# EAGLE design Linkwitz_mod (EAGLE 6.1)
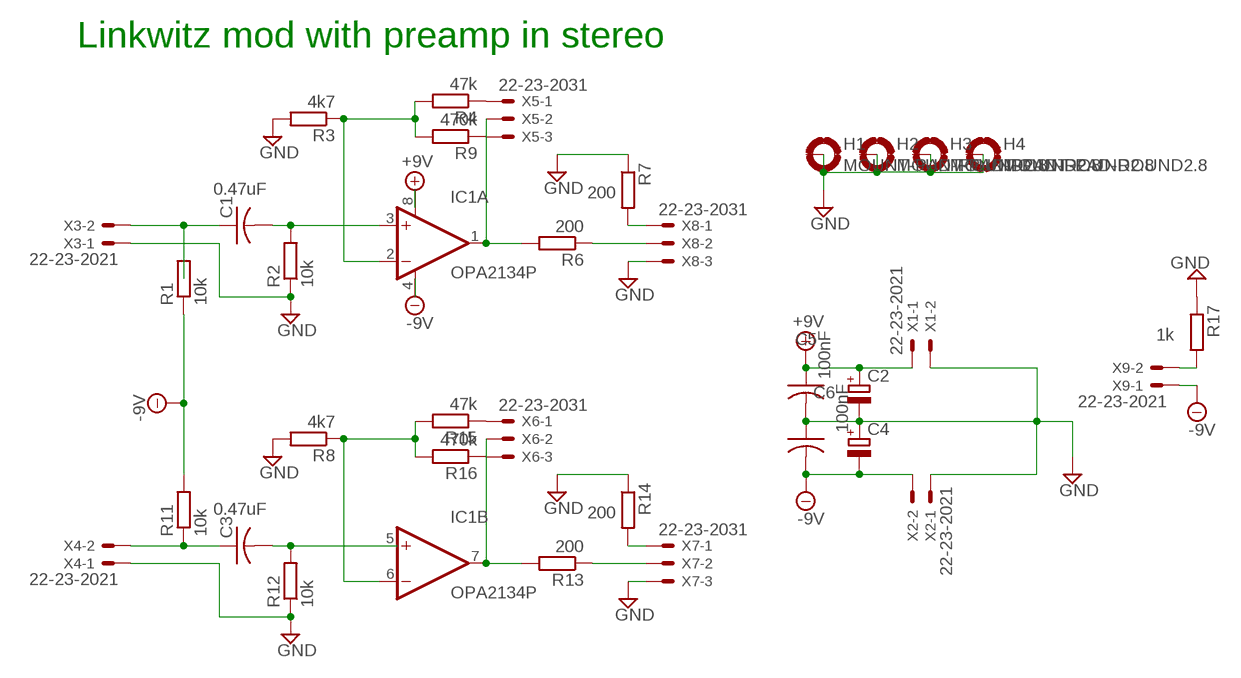
[diagram p0: schematic, sheet 1]

## Parts
C1  0.47uF  C-US050-030X075  [C050-030X075]
C2  CPOL-EUE2,5-6E  [E2,5-6E]
C3  0.47uF  C-US050-030X075  [C050-030X075]
C4  CPOL-EUE2,5-6E  [E2,5-6E]
C5  100nF  C-US050-030X075  [C050-030X075]
C6  100nF  C-US050-030X075  [C050-030X075]
H1  MOUNT-PAD-ROUND2.8  [2,8-PAD]
H2  MOUNT-PAD-ROUND2.8  [2,8-PAD]
H3  MOUNT-PAD-ROUND2.8  [2,8-PAD]
H4  MOUNT-PAD-ROUND2.8  [2,8-PAD]
IC1  OPA2134P  [DIL08]
R1  10k  R-EU_0309/10  [0309/10]
R2  10k  R-EU_0309/10  [0309/10]
R3  4k7  R-EU_0309/10  [0309/10]
R4  47k  R-EU_0309/10  [0309/10]
R6  200  R-EU_0309/10  [0309/10]
R7  200  R-EU_0309/10  [0309/10]
R8  4k7  R-EU_0309/10  [0309/10]
R9  470k  R-EU_0309/10  [0309/10]
R11  10k  R-EU_0309/10  [0309/10]
R12  10k  R-EU_0309/10  [0309/10]
R13  200  R-EU_0309/10  [0309/10]
R14  200  R-EU_0309/10  [0309/10]
R15  47k  R-EU_0309/10  [0309/10]
R16  470k  R-EU_0309/10  [0309/10]
R17  1k  R-EU_0309/10  [0309/10]
X1  22-23-2021  [22-23-2021]
X2  22-23-2021  [22-23-2021]
X3  22-23-2021  [22-23-2021]
X4  22-23-2021  [22-23-2021]
X5  22-23-2031  [22-23-2031]
X6  22-23-2031  [22-23-2031]
X7  22-23-2031  [22-23-2031]
X8  22-23-2031  [22-23-2031]
X9  22-23-2021  [22-23-2021]

## Nets
+9V: C2.+ C5.1 IC1.8(A:V+) X1.1
-9V: C4.- C6.2 IC1.4(A:V-) R1.1 R11.2 X2.2 X9.1
GND: C2.- C4.+ C5.2 C6.1 R2.1 R3.2 R7.1 R8.2 R12.1 R14.1 R17.1 X1.2 X2.1 X3.1 X4.1 X7.3 X8.3
N$1: C1.1 R1.2 X3.2
N$2: IC1.6(B:-IN) R8.1 R15.2 R16.2
N$3: IC1.2(A:-IN) R3.1 R4.2 R9.2
N$4: C1.2 IC1.3(A:+IN) R2.2
N$5: IC1.1(A:OUT) R6.2 X5.2
N$7: R14.2 X7.1
N$8: R6.1 X8.2
N$9: R4.1 X5.1
N$10: R9.1 X5.3
N$11: IC1.7(B:OUT) R13.2 X6.2
N$13: R7.2 X8.1
N$14: C3.1 R11.1 X4.2
N$15: C3.2 IC1.5(B:+IN) R12.2
N$16: R13.1 X7.2
N$17: R15.1 X6.1
N$18: R16.1 X6.3
N$19: R17.2 X9.2
Unconnected: H1.B2,8(MOUNT) H2.B2,8(MOUNT) H3.B2,8(MOUNT) H4.B2,8(MOUNT)

## Notes on the sheet
- Linkwitz mod with preamp in stereo

## Library data of the parts
C1 C3 C5 C6 = rcl:C-US: CAPACITOR, American symbol
C2 C4 = rcl:CPOL-EU: POLARIZED CAPACITOR, European symbol
H1-H4 = holes:MOUNT-PAD-ROUND: MOUNTING PAD, round
IC1 = burr-brown:OPA2134: Operational Amplifier; MF: TEXAS INSTRUMENTS; MPN: OPA2134PA; OC_FARNELL: 1097574; OC_NEWARK: 74K3897
R1-R4 R6-R9 R11-R17 = rcl:R-EU_: RESISTOR, European symbol
X1-X4 X9 = con-molex:22-23-2021: .100" (2.54mm) Center Header - 2 Pin; MF: MOLEX; MPN: 22-23-2021; OC_FARNELL: 1462926; OC_NEWARK: 25C3832
X5-X8 = con-molex:22-23-2031: .100" (2.54mm) Center Header - 3 Pin; MF: MOLEX; MPN: 22-23-2031; OC_FARNELL: 1462950; OC_NEWARK: 30C0862

## Board
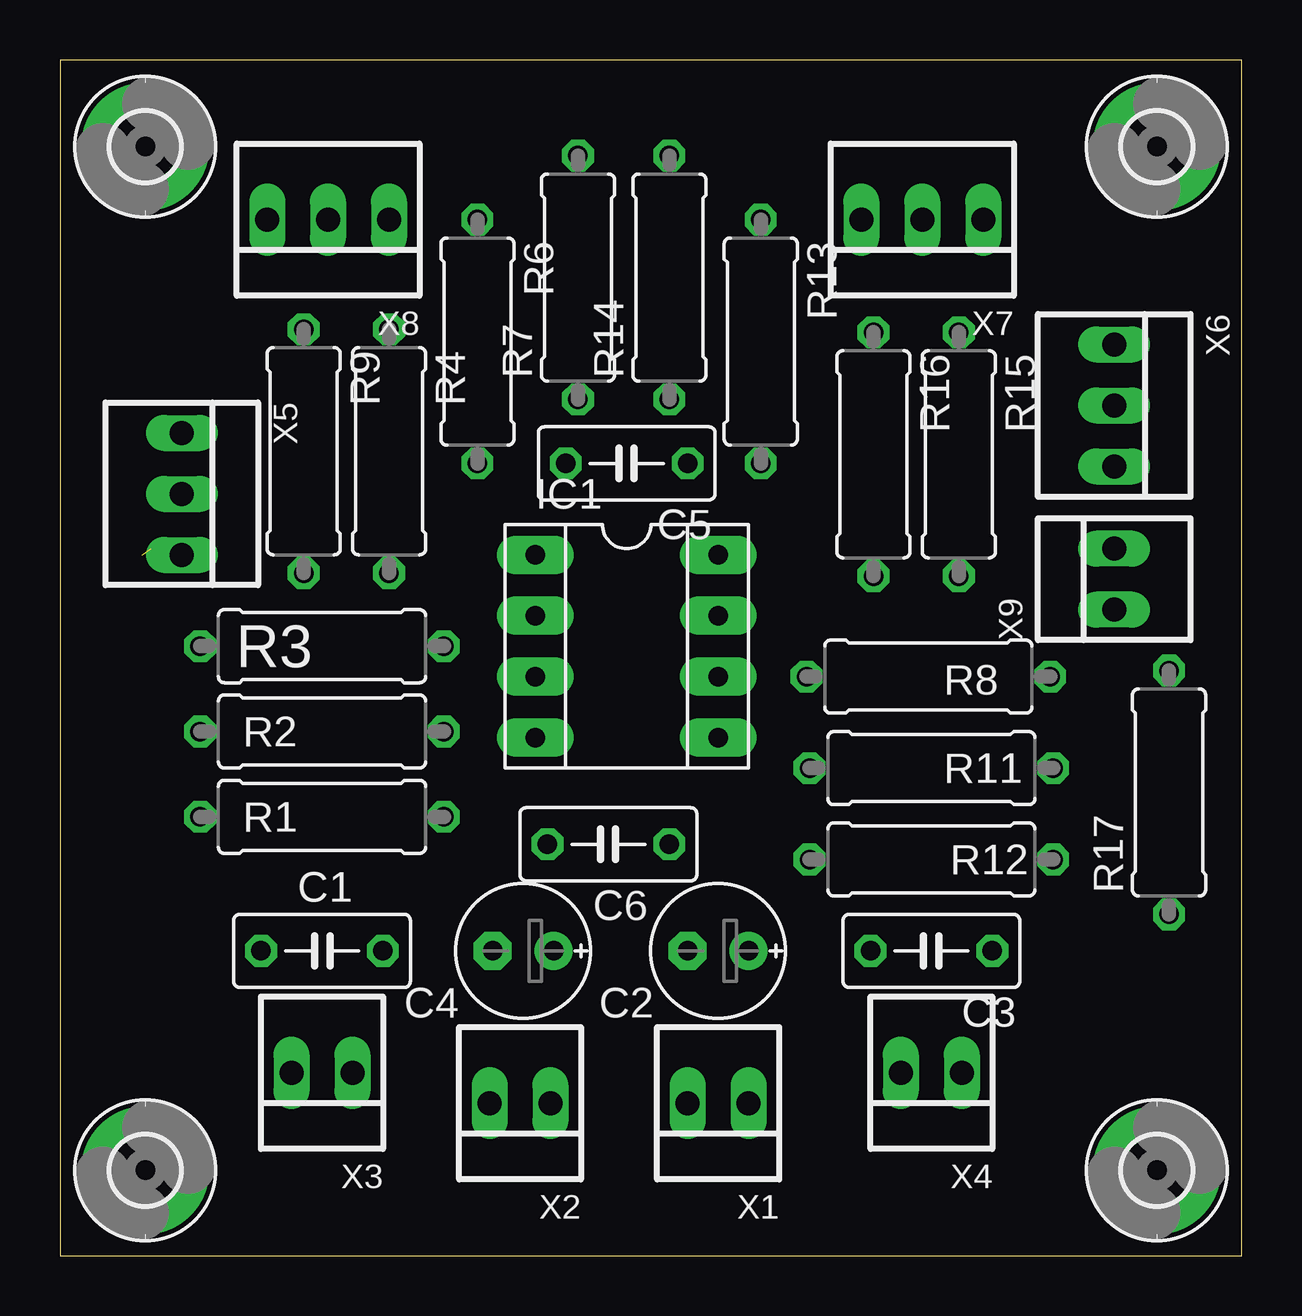
[diagram p1: board, top side]
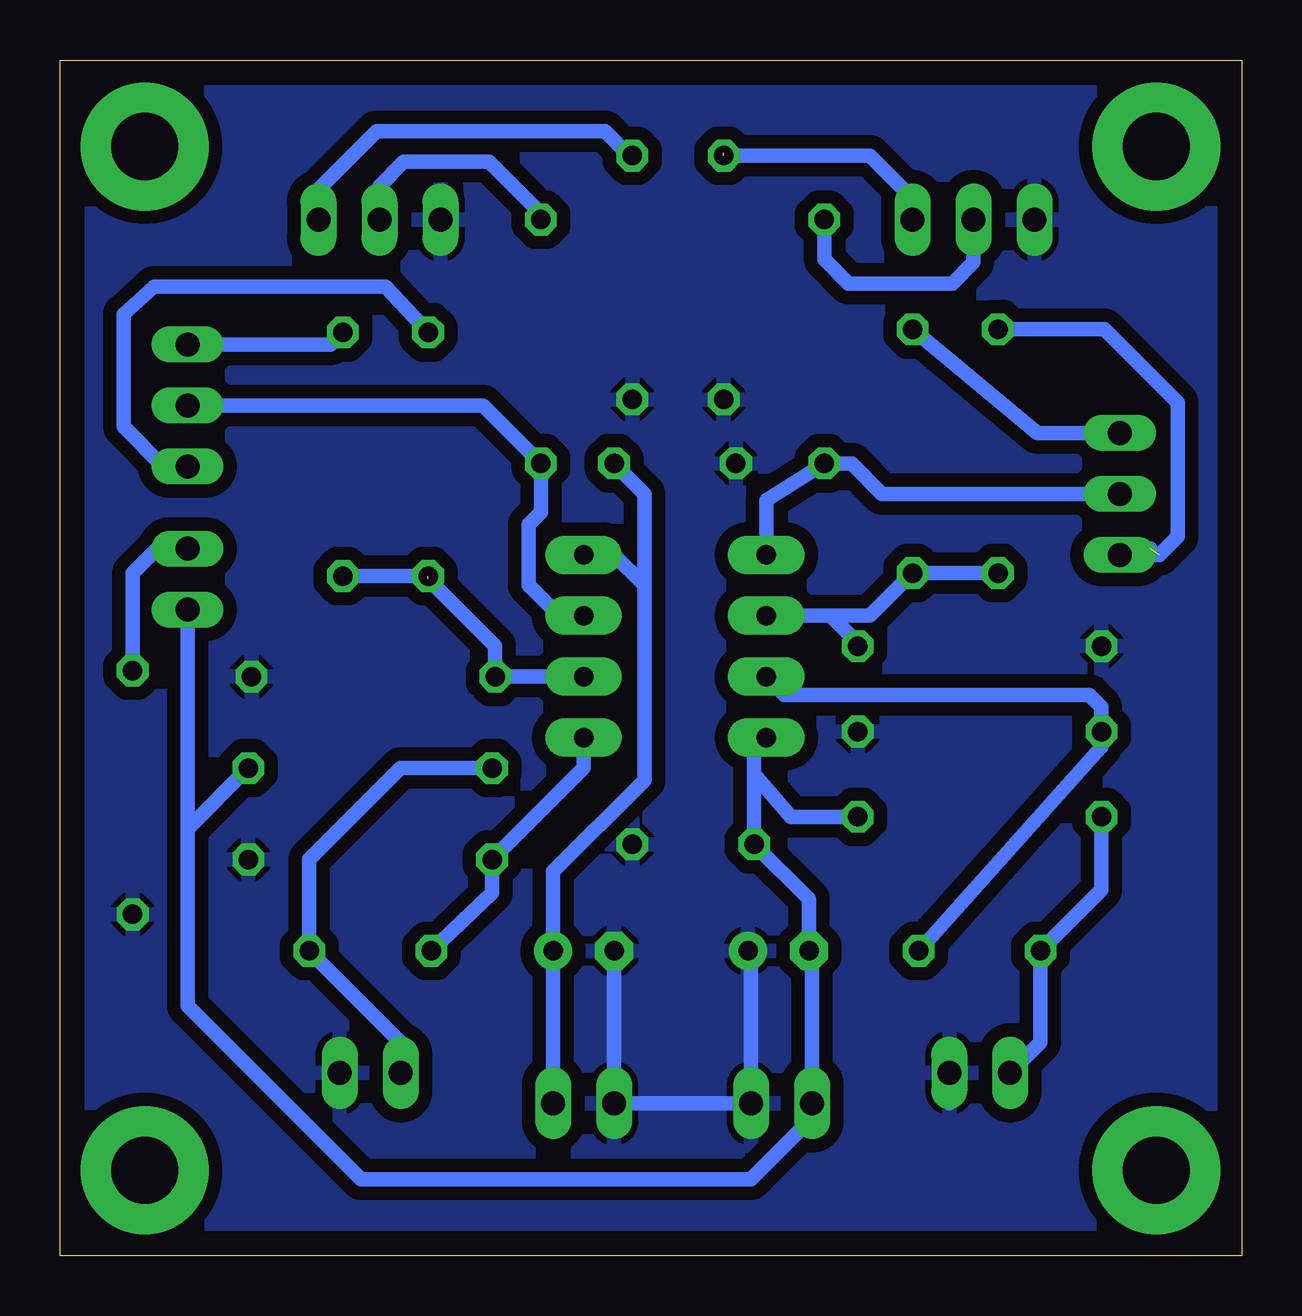
[diagram p2: board, bottom side, seen from below]

Size 49.26 x 49.84 mm. Coordinates in mm from the lower left corner, seen from the top.
Outline: 0,0 49.26,0 49.26,49.84 0,49.84 0,0
Copper layers (1*16): Top 0.035mm / dielectric 1.5mm / Bottom 0.035mm
Design rules: minimum track width 7mil, minimum drill 24mil, track to track 8mil, track to pad 8mil, pad to pad 8mil, via to via 8mil, smd to smd 8mil, copper to edge 40mil, drill to drill 8mil, minimum pad ring 10mil, minimum via ring 8mil, stop-mask expansion 4mil, vias tented up to drill 0mil, thermal gap 10mil

### Footprints (pad centres in the part's own frame; a part is rotated, then mirrored left to right if it is on the bottom)
C050-030X075 = drill 0.813 octagon: 1 -2.54,0; 2 2.54,0
E2,5-6E = drill 0.813 pad 1.575: + -1.27,0 | drill 0.813 pad 1.575 octagon: - 1.27,0
2,8-PAD = drill 2.8 pad 5.334: B2,8 0,0
DIL08 = drill 0.813 pad 1.6 long: 1 -8.89,-1.27; 2 -8.89,-3.81; 3 -8.89,-6.35; 4 -8.89,-8.89; 5 -1.27,-8.89; 6 -1.27,-6.35; 7 -1.27,-3.81; 8 -1.27,-1.27
0309/10 = drill 0.813 octagon: 1 -5.08,0; 2 5.08,0
22-23-2021 = drill 1 long: 1 -1.27,0; 2 1.27,0
22-23-2031 = drill 1 long: 1 -2.54,0; 2 0,0; 3 2.54,0

### Placement (x,y rotation side)
C1  10.92,12.7 0 top
C2  27.43,12.7 180 top
C3  36.32,12.7 180 top
C4  19.3,12.7 180 top
C5  23.62,33.02 180 top
C6  22.86,17.14 180 top
H1  3.56,3.56 0 top
H2  45.72,3.56 0 top
H3  45.72,46.23 0 top
H4  3.56,46.23 0 top
IC1  28.7,30.48 0 top
R1  10.92,18.29 180 top
R2  10.92,21.84 180 top
R3  10.92,25.4 180 top
R4  13.72,33.53 270 top
R6  17.4,38.1 270 top
R7  21.59,40.77 90 top
R8  36.2,24.13 0 top
R9  10.16,33.53 270 top
R11  36.32,20.32 0 top
R12  36.32,16.51 180 top
R13  29.21,38.1 270 top
R14  25.4,40.77 90 top
R15  37.47,33.4 270 top
R16  33.91,33.4 270 top
R17  46.23,19.3 90 top
X1  27.43,6.35 180 top
X2  19.18,6.35 180 top
X3  10.92,7.62 180 top
X4  36.32,7.62 180 top
X5  5.08,31.75 270 top
X6  43.94,35.43 270 top
X7  35.94,43.18 180 top
X8  11.18,43.18 180 top
X9  43.94,28.19 90 top

### Tracks (layer width: path | path; a pad name or v marks a point on that pad's centre or on a via)
+9V
  Bottom 0.61: 24.89,27.94 24.89,19.81 28.7,16 C2.+ X1.1 | 24.89,27.94 24.89,31.75 C5.1 | IC1.8 26.16,29.21 24.89,27.94
-9V
  Bottom 0.61: 20.32,20.07 C6.2 18.03,14.86 C4.- 17.91,12.57 X2.2 17.91,5.71 20.45,3.17 36.7,3.17 43.94,10.41 43.94,17.78 | 20.32,20.07 20.32,21.08 IC1.4 | R1.1 18.8,18.29 20.32,20.07 | X9.1 43.94,17.78 | R11.2 43.94,17.78
GND
  Bottom 0.61: X3.1 12.19,6.35 | 20.95,12.7 C4.+ 20.45,12.57 X2.1 X1.2 C2.-
  pour Bottom (isolate 0.559): -0.76,50.55 -0.64,-0.38 49.53,-0.51 49.78,50.55
N$1
  Bottom 0.61: R1.2 5.84,15.24 C1.1 8.38,8.89 X3.2
N$2  (1 unrouted)
  Bottom 0.61: IC1.6 R8.1 31.11,25.4 33.91,28.19 | R16.2 R15.2
N$3
  Bottom 0.61: 17.14,26.67 IC1.2 | R9.2 R4.2 15.49,26.67 17.14,26.67 | 17.14,26.67 16,25.53 R3.1
N$4
  Bottom 0.61: C1.2 5.84,21.21 R2.2 5.84,22.86 6.35,23.37 19.05,23.37 IC1.3 19.56,24.38
N$5
  Bottom 0.61: IC1.1 19.81,31.5 R6.2 16.26,33.02 14.99,31.75 X5.2
N$7
  Bottom 0.61: X7.1 38.48,44.45 36.07,46.86 26.54,46.86 25.53,45.85 R14.2
N$8
  Bottom 0.61: X8.2 11.18,41.4 12.06,40.51 16.38,40.51 17.4,41.53 R6.1
N$9
  Bottom 0.61: X5.1 8.51,34.29 R4.1
N$10  (1 unrouted)
  Bottom 0.61: 3.81,29.46 4.06,29.21 | R9.1 5.71,38.61 2.67,35.56 2.67,29.97 3.43,29.21 X5.3
N$11
  Bottom 0.61: IC1.7 28.45,26.67 29.72,27.94 29.72,30.48 29.21,30.99 R13.2 31.62,35.43 X6.2
N$13  (1 unrouted)
  Bottom 0.61: 21.72,46.1 21.59,45.97 | 21.34,45.59 R7.2 15.49,45.85 13.72,44.07 X8.1
N$14
  Bottom 0.61: X4.2 35.05,8.89 C3.1 38.86,16.51 35.05,20.32 R11.1
N$15
  Bottom 0.61: C3.2 31.24,15.11 R12.2 27.43,20.32 IC1.5
N$16
  Bottom 0.61: X7.2 35.94,44.58 34.92,45.59 31.37,45.59 29.21,43.43 R13.1
N$17
  Bottom 0.61: X6.1 37.97,37.97 R15.1
N$18
  Bottom 0.61: R16.1 35.69,40.39 45.34,40.39 46.61,39.24 46.61,34.54 44.96,32.89 X6.3
N$19
  Bottom 0.61: X9.2 45.21,29.46 46.23,28.45 R17.2